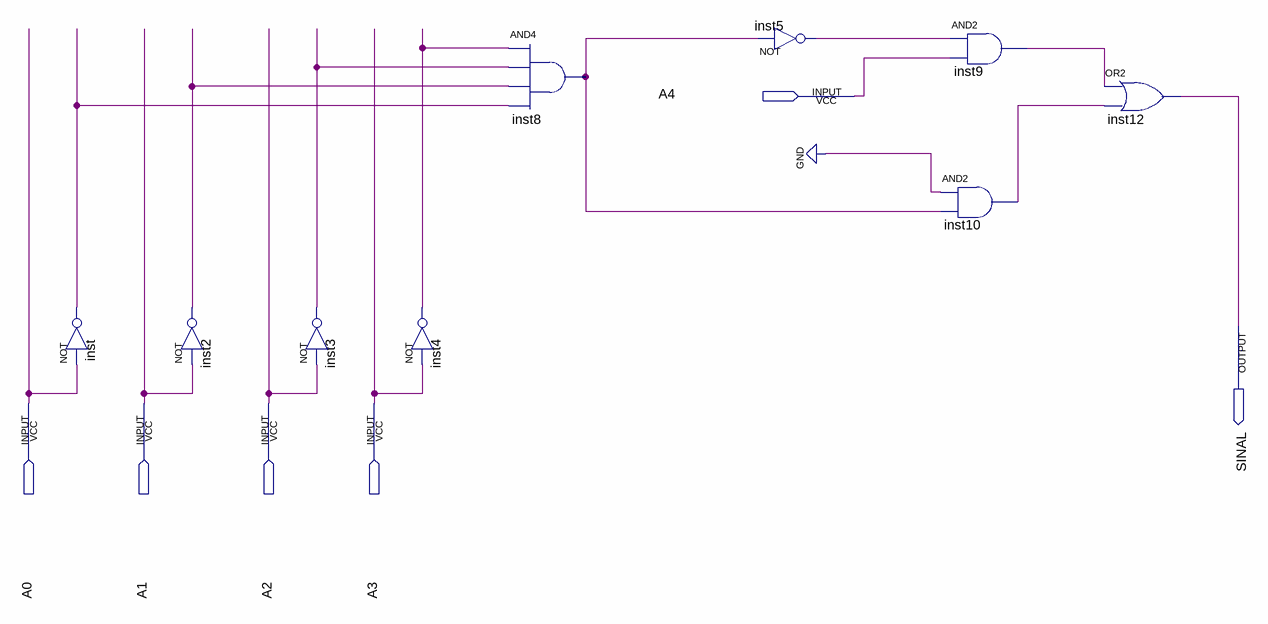
[diagram p0: schematic sheet]
// Quartus schematic EhZero.bdf as structural Verilog: 9 symbols, 6 pins
module EhZero (
  input  A4,
  input  A0,
  input  A1,
  input  A2,
  input  A3,
  output SINAL
);

  wire inst2_out, inst3_out, inst4_out, inst5_out, inst8_out, inst9_out, inst10_out, inst_out;

  not inst (inst_out, A0);
  not inst2 (inst2_out, A1);
  not inst3 (inst3_out, A2);
  not inst4 (inst4_out, A3);
  and inst8 (inst8_out, inst4_out, inst3_out, inst2_out, inst_out);
  not inst5 (inst5_out, inst8_out);
  and inst9 (inst9_out, inst5_out, A4);
  and inst10 (inst10_out, 1'b0, inst8_out);
  or inst12 (SINAL, inst9_out, inst10_out);
endmodule
